# EAGLE design akabeacon_mini (EAGLE 6.5.0)
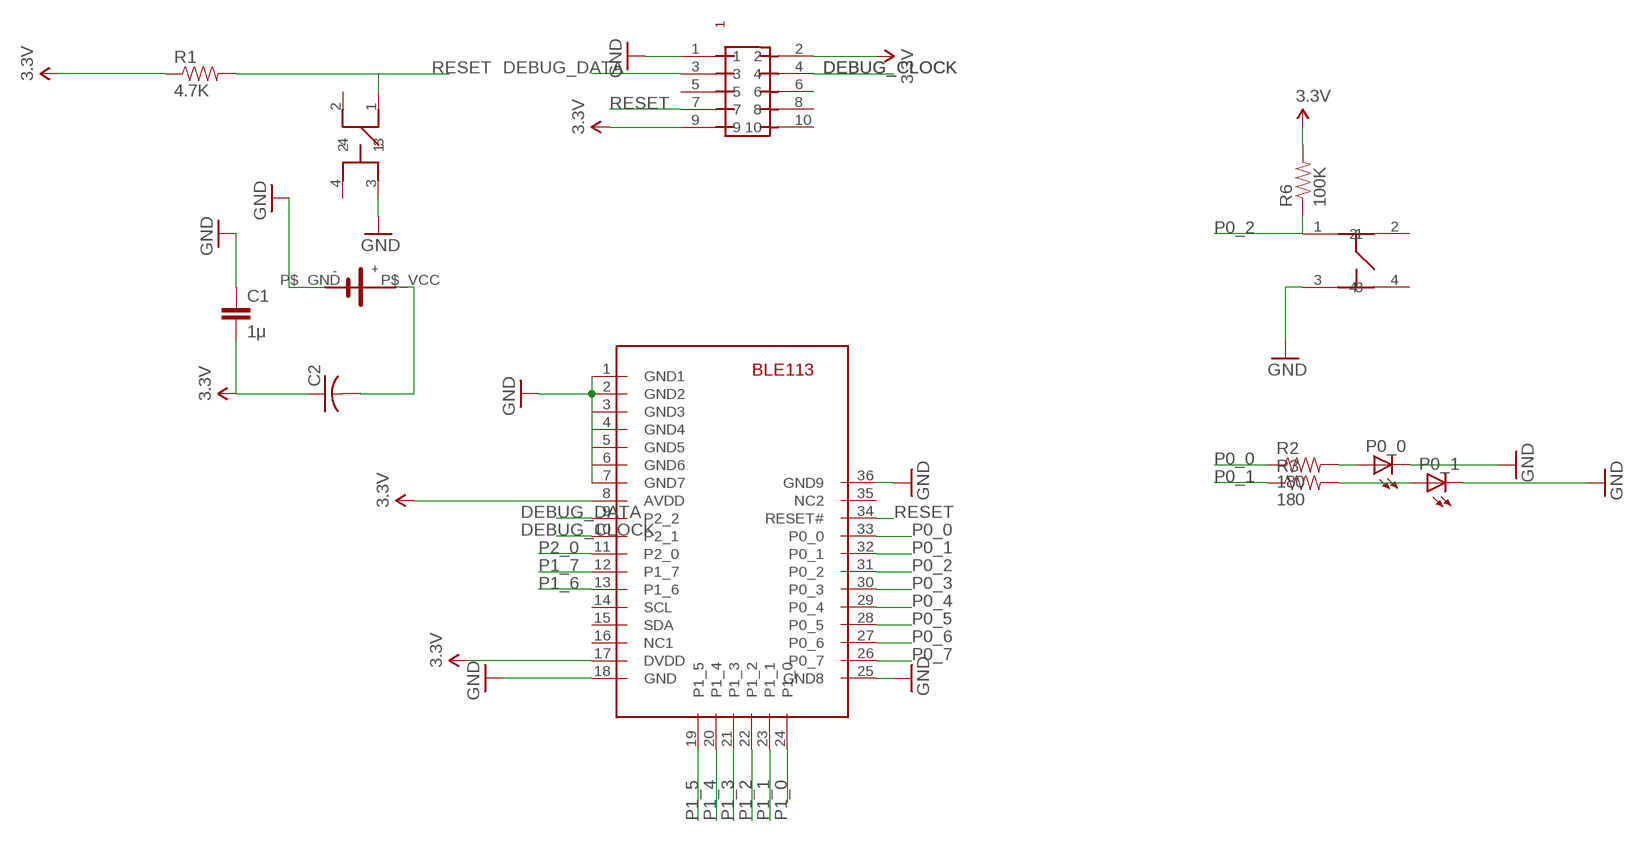
[diagram p0: schematic, sheet 1]

## Parts
C1  1μ  CAP0603-CAP  [0603-CAP]
C2  C-USC3225  [C3225]
P0_0  LEDCHIP-LED0603  [CHIP-LED0603]
P0_1  LEDCHIP-LED0603  [CHIP-LED0603]
R1  4.7K  RESISTOR0603-RES  [0603-RES]
R2  180  RESISTOR0603-RES  [0603-RES]
R3  180  RESISTOR0603-RES  [0603-RES]
R6  100K  RESISTOR0603-RES  [0603-RES]
U$1  SMTU2450-BOTTOM-MINI  [SMTU2450-BOTTOM-MINI]
U$2  SWITCH-LS6J2M-T  [SWICTH-LS6J2M-T]
U$3  PIN-HEADER-SMT(1.27MM)2X5  [PIN-HEADER-SMT(1.27MM)2X5]
U$4  BLE113  [BLE113]
U$5  SWICTH-4P(KMR2)  [SWITCH-4P(KMR2)]

## Nets
3.3V: C1.2 C2.1 R1.1 R6.2 U$3.2 U$3.9 U$4.8(AVDD) U$4.17(DVDD)
DEBUG_CLOCK: U$3.4 U$4.10(P2_1)
DEBUG_DATA: U$3.3 U$4.9(P2_2)
GND: C1.1 P0_0.C P0_1.C U$1.P$_GND U$2.3 U$3.1 U$4.1(GND1) U$4.2(GND2) U$4.3(GND3) U$4.4(GND4) U$4.5(GND5) U$4.6(GND6) U$4.7(GND7) U$4.18(GND) U$4.25(GND8) U$4.36(GND9) U$5.3
N$1: C2.2 U$1.P$_VCC
N$2: P0_0.A R2.2
N$3: P0_1.A R3.2
P0_0: R2.1 U$4.33(P0_0)
P0_1: R3.1 U$4.32(P0_1)
P0_2: R6.1 U$4.31(P0_2) U$5.1
P0_3: U$4.30(P0_3)
P0_4: U$4.29(P0_4)
P0_5: U$4.28(P0_5)
P0_6: U$4.27(P0_6)
P0_7: U$4.26(P0_7)
P1_0: U$4.24(P1_0)
P1_1: U$4.23(P1_1)
P1_2: U$4.22(P1_2)
P1_3: U$4.21(P1_3)
P1_4: U$4.20(P1_4)
P1_5: U$4.19(P1_5)
P1_6: U$4.13(P1_6)
P1_7: U$4.12(P1_7)
P2_0: U$4.11(P2_0)
RESET: R1.2 U$2.1 U$3.7 U$4.34(RESET#)
Unconnected: U$2.2 U$2.4 U$3.5 U$3.6 U$3.8 U$3.10 U$4.14(SCL) U$4.15(SDA) U$4.16(NC1) U$4.35(NC2) U$5.2 U$5.4

## Library data of the parts
C1 = SparkFun:CAP: Capacitor Standard 0603 ceramic capacitor, and 0.1" leaded capacitor.
C2 = rcl:C-US: CAPACITOR, American symbol
P0_0 P0_1 = led:LED: LED OSRAM: - CHIPLED LG R971, LG N971, LY N971, LG Q971, LY Q971, LO R971, LY R971 LH N974, LH R974 LS Q976, LO Q976, LY Q976 LO Q996 - Hyper CHIPLED LW Q18S LB Q993, LB Q99A, LB R99A - SideLED LS A670, LO A670, LY A670, LG A670, LP A670 LB A673, LV A673, LT A673, LW A673 LH A674 LY A675 LS A676, LA A676, LO A676, LY A676, LW A676 LS A679, LY A679, LG A679 - Hyper Micro SIDELED® LS Y876, LA Y876, LO Y876, LY Y876 LT Y87S - SmartLED LW L88C, LW L88S LB L89C, LB L89S, LG L890 LS L89K, LO L89K, LY L89K LS L896, LA L896, LO L896, LY L896 - TOPLED LS T670, LO T670, LY T670, LG T670, LP T670 LSG T670, LSP T670, LSY T670, LOP T670, LYG T670 LG T671, LOG T671, LSG T671 LB T673, LV T673, LT T673, LW T673 LH T674 LS T676, LA T676, LO T676, LY T676, LB T676, LH T676, LSB T676, LW T676 LB T67C, LV T67C, LT T67C, LS T67K, LO T67K, LY T67K, LW E67C LS E67B, LA E67B, LO E67B, LY E67B, LB E67C, LV E67C, LT E67C LW T67C LS T679, LY T679, LG T679 LS T770, LO T770, LY T770, LG T770, LP T770 LB T773, LV T773, LT T773, LW T773 LH T774 LS E675, LA E675, LY E675, LS T675 LS T776, LA T776, LO T776, LY T776, LB T776 LHGB T686 LT T68C, LB T68C - Hyper Mini TOPLED® LB M676 - Mini TOPLED Santana® LG M470 LS M47K, LO M47K, LY M47K Source: http://www.osram.convergy.de LUXEON: - LUMILED® LXK2-PW12-R00, LXK2-PW12-S00, LXK2-PW14-U00, LXK2-PW14-V00 LXK2-PM12-R00, LXK2-PM12-S00, LXK2-PM14-U00 LXK2-PE12-Q00, LXK2-PE12-R00, LXK2-PE12-S00, LXK2-PE14-T00, LXK2-PE14-U00 LXK2-PB12-K00, LXK2-PB12-L00, LXK2-PB12-M00, LXK2-PB14-N00, LXK2-PB14-P00, LXK2-PB14-Q00 LXK2-PR12-L00, LXK2-PR12-M00, LXK2-PR14-Q00, LXK2-PR14-R00 LXK2-PD12-Q00, LXK2-PD12-R00, LXK2-PD12-S00 LXK2-PH12-R00, LXK2-PH12-S00 LXK2-PL12-P00, LXK2-PL12-Q00, LXK2-PL12-R00 Source: www.luxeon.com KINGBRIGHT: KA-3528ASYC Source: www.kingbright.com
R1-R3 R6 = SparkFun:RESISTOR: Resistor Basic schematic elements and footprints for 0603, 1206, and PTH resistors.
U$1 = gclue:SMTU2450-BOTTOM-MINI
U$2 = gclue:SWITCH-LS6J2M-T
U$3 = gclue-test:PIN-HEADER-SMT(1.27MM)2X5: PIN-HEADER-SMT (1.27MM) 2x5
U$4 = gclue:BLE113
U$5 = gclue-test:SWICTH-4P(KMR2)

## Board
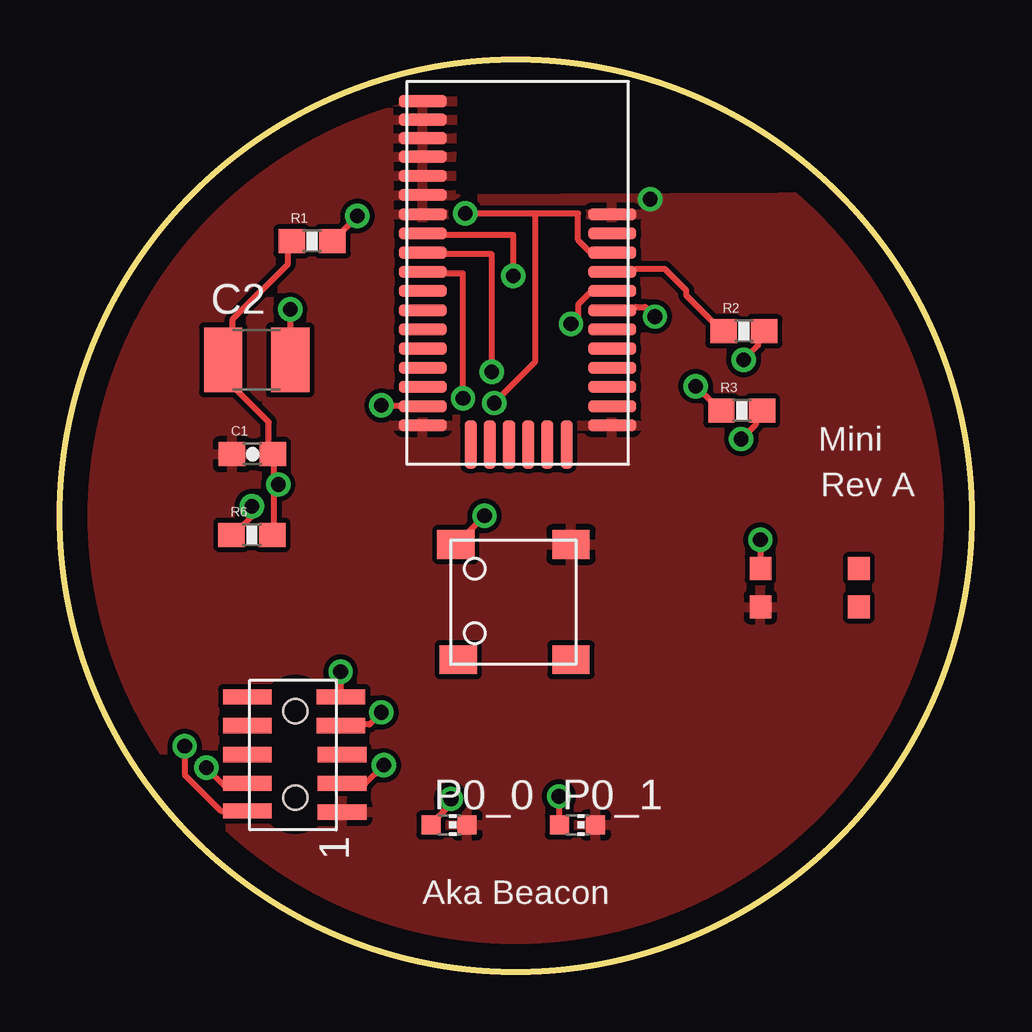
[diagram p1: board, top side]
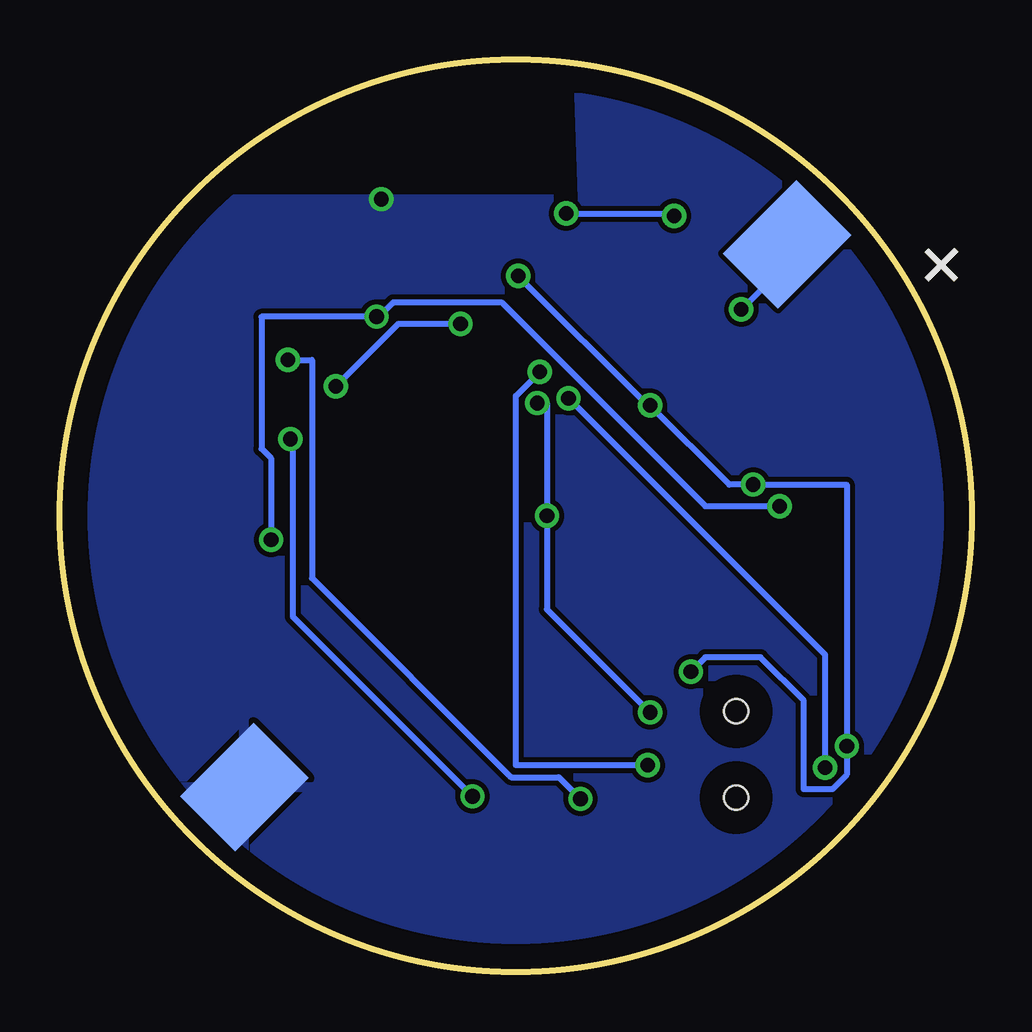
[diagram p2: board, bottom side, seen from below]

Size 38 x 38 mm. Coordinates in mm from the lower left corner, seen from the top.
Outline: circle at 19,19 radius 19
Copper layers (1*16): Top 0.035mm / dielectric 1.5mm / Bottom 0.035mm
Design rules "default": minimum track width 10mil, minimum drill 24mil, track to track 8mil, track to pad 8mil, pad to pad 8mil, via to via 8mil, smd to smd 8mil, copper to edge 40mil, drill to drill 8mil, minimum pad ring 10mil, minimum via ring 8mil, stop-mask expansion 4mil, vias tented up to drill 0mil, thermal gap 10mil

### Footprints (pad centres in the part's own frame; a part is rotated, then mirrored left to right if it is on the bottom)
0603-CAP = smd 1.1 x 1: 1 -0.85,0; 2 0.85,0
C3225 = smd 1.6 x 2.7: 1 -1.4,0; 2 1.4,0
CHIP-LED0603 = smd 0.8 x 0.8: A 0,-0.75; C 0,0.75
0603-RES = smd 1.1 x 1: 1 -0.85,0; 2 0.85,0
SMTU2450-BOTTOM-MINI = smd 3.251 x 4.318 bottom: P$_GND 0,-16; P$_VCC 0,16
SWICTH-LS6J2M-T = smd 1.55 x 1.2: 1 -2.4,2.4; 2 -2.3,-2.4; 3 2.4,2.4; 4 2.4,-2.4
PIN-HEADER-SMT(1.27MM)2X5 = smd 0.635 x 2.032: 1 -2.8,-1.65; 2 -2.75,2.3; 3 -1.6,-1.65; 4 -1.6,2.3; 5 -0.4,-1.65; 6 -0.4,2.3; 7 0.8,-1.6; 8 0.8,2.3; 9 2,-1.6; 10 2,2.3 | hole 1: 1.4,0.3; -2.2,0.3
BLE113 = smd 2 x 0.5: 1 -5.08,5.08; 2 -5.08,4.31; 3 -5.08,3.54; 4 -5.08,2.77; 5 -5.08,1.97; 6 -5.08,1.17; 7 -5.08,0.37; 8 -5.08,-0.43; 9 -5.08,-1.23; 10 -5.08,-2.03; 11 -5.08,-2.83; 12 -5.08,-3.63; 13 -5.08,-4.43; 14 -5.08,-5.23; 15 -5.08,-6.03; 16 -5.08,-6.83; 17 -5.08,-7.63; 18 -5.08,-8.43; 25 2.82,-8.43; 26 2.82,-7.63; 27 2.82,-6.83; 28 2.82,-6.03; 29 2.82,-5.23; 30 2.82,-4.43; 31 2.82,-3.63; 32 2.82,-2.83; 33 2.82,-2.03; 34 2.82,-1.23; 35 2.82,-0.43; 36 2.82,0.37 | smd 0.5 x 2: 19 -3.08,-9.23; 20 -2.28,-9.23; 21 -1.48,-9.23; 22 -0.68,-9.23; 23 0.12,-9.23; 24 0.92,-9.23
SWITCH-4P(KMR2) = smd 0.9 x 0.95: 1 -1,0; 2 3.1,0; 3 -1,-1.6; 4 3.1,-1.6

### Placement (x,y rotation side)
C1  8.02,21.57 0 top
C2  8.2,25.5 0 top
P0_0  16.22,6.11 270 top
P0_1  21.57,6.11 270 top
R1  10.51,30.44 0 top
R2  28.51,26.7 0 top
R3  28.42,23.38 0 top
R6  8,18.2 0 top
U$1  19,19 45 top
U$2  18.9,15.4 0 top
U$3  10.11,9.45 90 top
U$4  20.2,31.2 0 top
U$5  30.2,16.8 0 top

### Tracks (layer width: path | path; a pad name or v marks a point on that pad's centre or on a via)
3.3V  (via drill 0.61)
  Top 0.254: R1.1 9.6,30.4 9.5,30.3 9.5,29.5 7.2,27.2 7.2,25.9 C2.1 6.8,25.4 7.4,24.8 7.4,24.2 8.7,22.9 8.7,21.7 8.8,21.6 C1.2 8.9,21.5 8.9,20.3 | 8.9,20.3 8.9,18.2 R6.2 | v13.4,23.6 15.1,23.6 U$4.17 | v9.1,20.3 8.9,20.3 | v18.9,29 18.9,30.7 15.2,30.7 U$4.8 | v5.2,9.4 5.2,8.2 6.7,6.7 U$3.2 | v11.7,12.5 11.7,11.5 U$3.9
  Bottom 0.254: v18.9,29 13.5,23.6 v13.4,23.6 10.1,20.3 v9.1,20.3 5.2,20.3 v5.2,9.4 5.2,8.2 5.8,7.6 7,7.6 7,11.3 8.8,13.1 11.1,13.1 v11.7,12.5
DEBUG_CLOCK  (via drill 0.61)
  Top 0.254: v16.8,23.9 16.8,29.1 15.2,29.1 U$4.10 | v6.1,8.5 6.9,7.7 7.8,7.7 7.8,7.8 U$3.4
  Bottom 0.254: v16.8,23.9 6.1,13.2 v6.1,8.5
DEBUG_DATA  (via drill 0.61)
  Top 0.254: v18,25 18,29.9 15.2,29.9 U$4.9 | v13.5,8.6 12.7,7.8 11.8,7.8 U$3.3
  Bottom 0.254: v18,25 19,24 19,8.6 v13.5,8.6
GND  (via drill 0.61)
  other vias: 24.6,32.2
  pour Bottom: -1.5,-1.6 38.8,-3 39.1,32.2 16.2,32.2 16.4,38.4 -0.7,38.2 -1.8,-1.5
  pour Top: -1.5,-1.4 38.7,-2.7 39.1,32.3 16.3,32.2 16.4,38.3 -0.7,38 -1.5,-0.9
N$1  (via drill 0.61)
  Top 0.254: v9.6,27.6 C2.2
  Bottom 0.254: v9.6,27.6 7.7,29.5 U$1.P$_VCC
N$2  (via drill 0.61)
  Top 0.254: v16.3,7.2 16.3,7 15.5,6.2 P0_0.A | v28.5,25.5 29.1,26.1 29.1,26.4 29.3,26.6 R2.2
  Bottom 0.254: v16.3,7.2 17.2,8.1 19.2,8.1 27.5,16.4 27.5,25.5 v28.5,25.5
N$3  (via drill 0.61)
  Top 0.254: v20.8,7.3 20.8,6.2 P0_1.A | v28.4,22.2 29,22.8 29,23.1 29.2,23.3 R3.2
  Bottom 0.254: v20.8,7.3 28.3,14.8 28.3,22.2 v28.4,22.2
P0_0
  Top 0.254: R2.1 27.6,26.7 26.1,28.2 26.1,28.4 25.2,29.3 24,29.3 23.9,29.2 23.1,29.2 U$4.33
P0_1  (via drill 0.61)
  Top 0.254: v26.5,24.4 27.5,23.4 R3.1 | v21.3,27 21.6,27.3 21.6,27.8 22.1,28.3 23,28.3 U$4.32
  Bottom 0.254: v26.5,24.4 23.9,27 v21.3,27
P0_2  (via drill 0.61)
  Top 0.254: v29.2,18 U$5.1 | v24.8,27.3 24.4,27.7 24,27.7 23.9,27.6 23.1,27.6 U$4.31 | v8,19.4 8,19 7.2,18.2 R6.1
  Bottom 0.254: v29.2,18 29.2,21.4 29.6,21.8 29.6,27.3 v24.8,27.3 24.7,27.3 24.1,27.9 19.6,27.9 11.1,19.4 v8,19.4
RESET  (via drill 0.61)
  Top 0.254: v12.4,31.5 11.4,30.5 R1.2 | 19.8,31.6 21.6,31.6 21.6,30.5 22.1,30 23,30 U$4.34 | 19.8,31.6 v16.9,31.6 | v17.7,19 U$2.1 | v18.1,23.7 19.8,25.4 19.8,31.6 | v13.4,10.8 12.9,10.3 11.8,10.3 U$3.7
  Bottom 0.254: v12.4,31.5 12.5,31.6 v16.9,31.6 | v18.1,23.7 17.7,23.7 v17.7,19 17.7,15.1 v13.4,10.8

### Text on the board
tPlace: Mini | Rev A | Aka Beacon